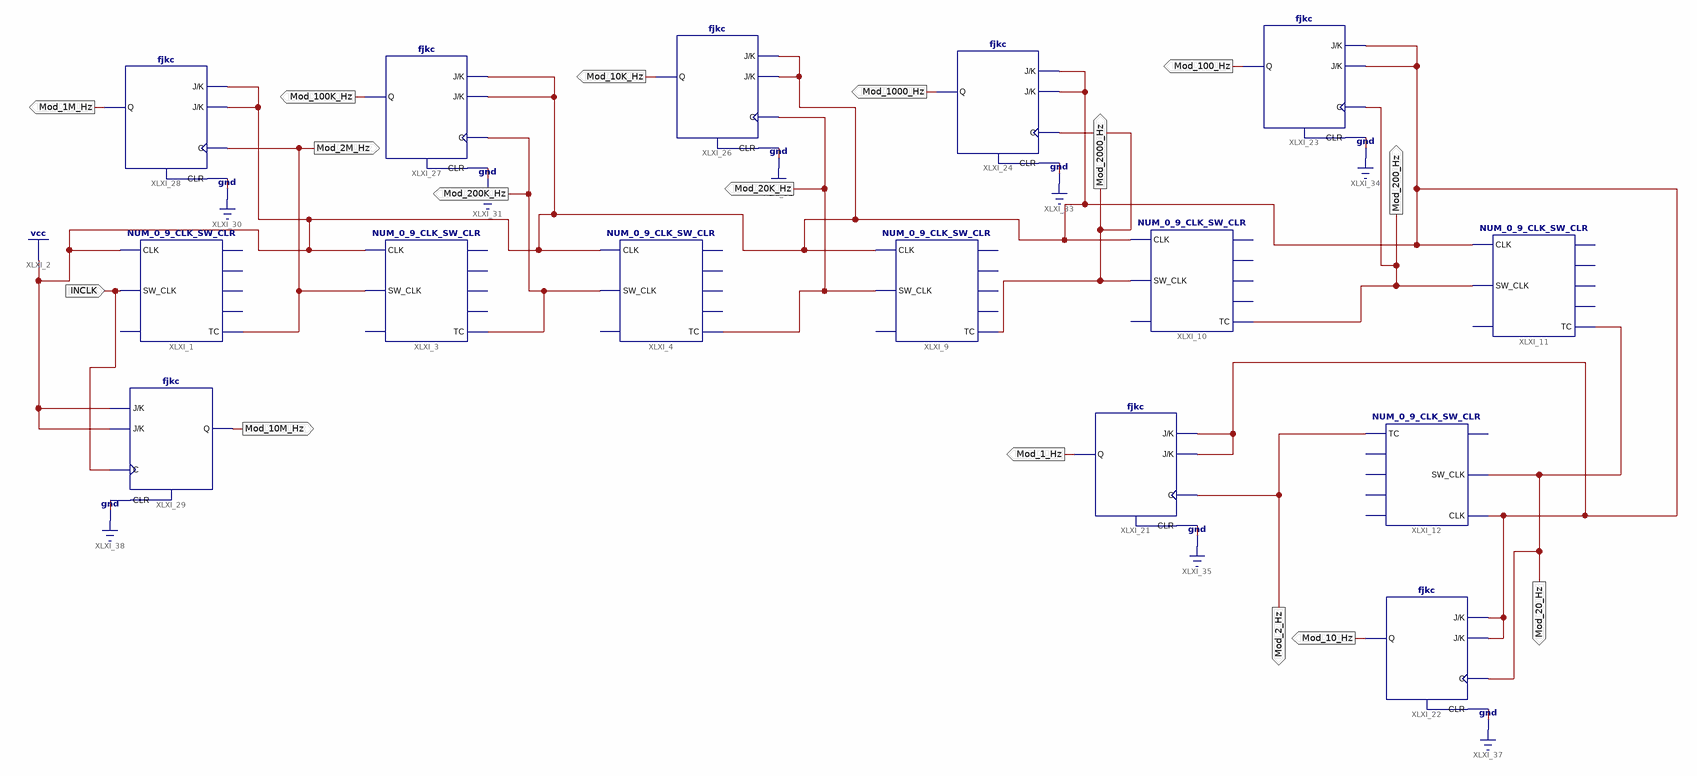
[diagram p0: schematic sheet 1]
// Xilinx ISE schematic ModSelect.sch (spartan6) as structural Verilog: 15 symbols, 16 ports
module ModSelect (
  input  INCLK,
  output Mod_2M_Hz,
  output Mod_200K_Hz,
  output Mod_20K_Hz,
  output Mod_2000_Hz,
  output Mod_200_Hz,
  output Mod_20_Hz,
  output Mod_2_Hz,
  output Mod_1_Hz,
  output Mod_10_Hz,
  output Mod_100_Hz,
  output Mod_1000_Hz,
  output Mod_10K_Hz,
  output Mod_100K_Hz,
  output Mod_1M_Hz,
  output Mod_10M_Hz
);

  NUM_0_9_CLK_SW_CLR XLXI_1 (.CLK(1'b1), .SW_CLK(INCLK), .TC(Mod_2M_Hz));  // open: CLR, B, C, A, D
  NUM_0_9_CLK_SW_CLR XLXI_3 (.CLK(1'b1), .SW_CLK(Mod_2M_Hz), .TC(Mod_200K_Hz));  // open: CLR, B, C, A, D
  NUM_0_9_CLK_SW_CLR XLXI_4 (.CLK(1'b1), .SW_CLK(Mod_200K_Hz), .TC(Mod_20K_Hz));  // open: CLR, B, C, A, D
  NUM_0_9_CLK_SW_CLR XLXI_9 (.CLK(1'b1), .SW_CLK(Mod_20K_Hz), .TC(Mod_2000_Hz));  // open: CLR, B, C, A, D
  NUM_0_9_CLK_SW_CLR XLXI_10 (.CLK(1'b1), .SW_CLK(Mod_2000_Hz), .TC(Mod_200_Hz));  // open: CLR, B, C, A, D
  NUM_0_9_CLK_SW_CLR XLXI_11 (.CLK(1'b1), .SW_CLK(Mod_200_Hz), .TC(Mod_20_Hz));  // open: CLR, B, C, A, D
  NUM_0_9_CLK_SW_CLR XLXI_12 (.CLK(1'b1), .SW_CLK(Mod_20_Hz), .TC(Mod_2_Hz));  // open: CLR, B, C, A, D
  fjkc XLXI_21 (.C(Mod_2_Hz), .CLR(1'b0), .J(1'b1), .K(1'b1), .Q(Mod_1_Hz));
  fjkc XLXI_22 (.C(Mod_20_Hz), .CLR(1'b0), .J(1'b1), .K(1'b1), .Q(Mod_10_Hz));
  fjkc XLXI_23 (.C(Mod_200_Hz), .CLR(1'b0), .J(1'b1), .K(1'b1), .Q(Mod_100_Hz));
  fjkc XLXI_24 (.C(Mod_2000_Hz), .CLR(1'b0), .J(1'b1), .K(1'b1), .Q(Mod_1000_Hz));
  fjkc XLXI_26 (.C(Mod_20K_Hz), .CLR(1'b0), .J(1'b1), .K(1'b1), .Q(Mod_10K_Hz));
  fjkc XLXI_27 (.C(Mod_200K_Hz), .CLR(1'b0), .J(1'b1), .K(1'b1), .Q(Mod_100K_Hz));
  fjkc XLXI_28 (.C(Mod_2M_Hz), .CLR(1'b0), .J(1'b1), .K(1'b1), .Q(Mod_1M_Hz));
  fjkc XLXI_29 (.C(INCLK), .CLR(1'b0), .J(1'b1), .K(1'b1), .Q(Mod_10M_Hz));
endmodule
